# EAGLE design spacecam (EAGLE 6.1)
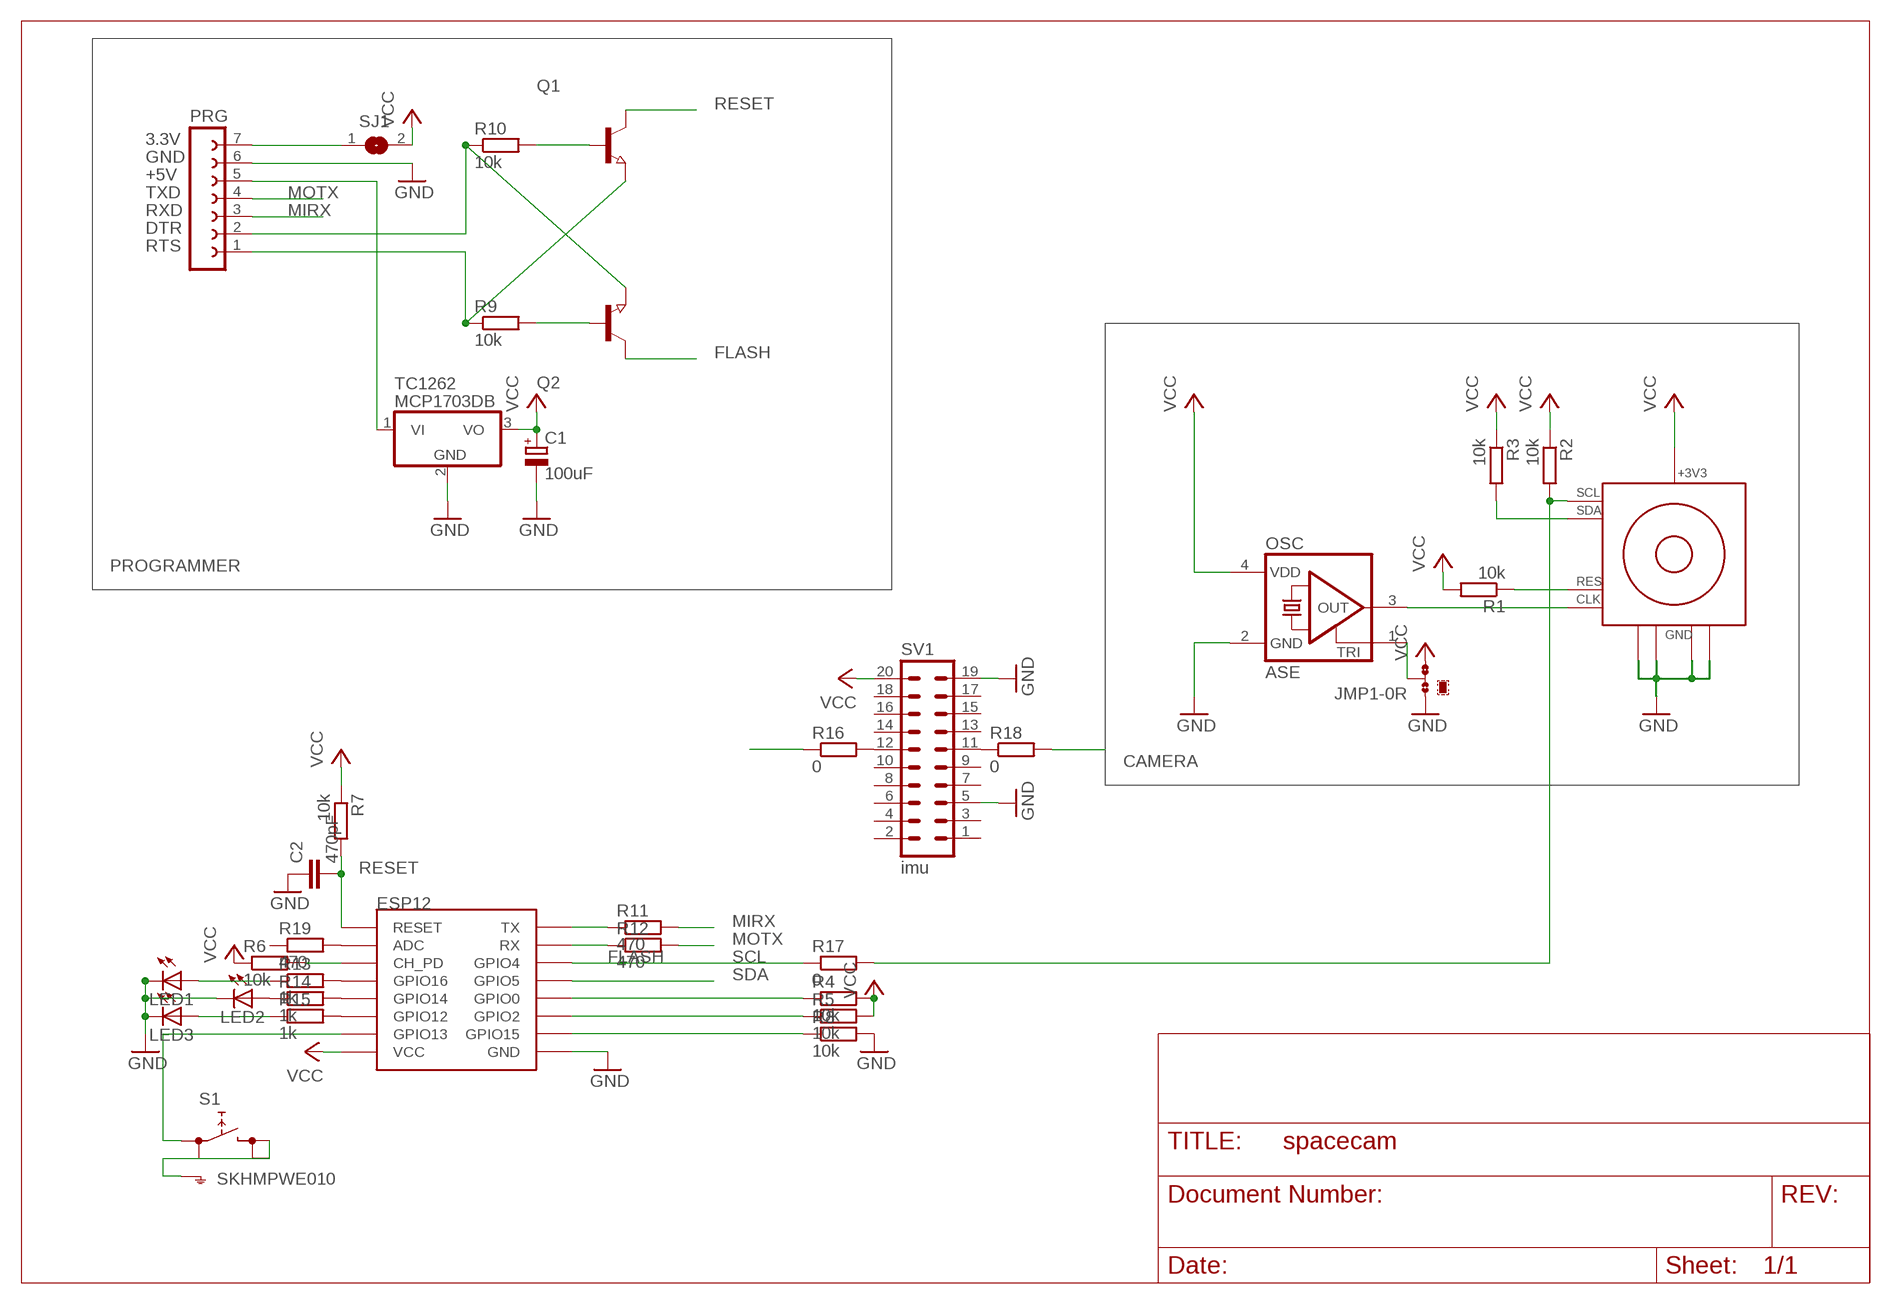
[diagram p0: schematic, sheet 1]

## Parts
C1  100uF  CPOL-EU153CLV-0605  [153CLV-0605]
C2  470pF  C-EUC0603  [C0603]
ESP12  ESP12SMD  [ESP12-SMD]
IR1  Wiimote IR  WII_IR_SENSOR  [WII_IR_SENSOR]
JMP1  0R-JUMPB  [B0R-JMP]
LED1  LEDSML0603  [SML0603]
LED2  LEDSML0603  [SML0603]
LED3  LEDSML0603  [SML0603]
OSC  ASE  [ASE]
PRG  FE07-1  [FE07]
Q1  NPN-TRANSISTOR_SOT23  [SOT23]
Q2  NPN-TRANSISTOR_SOT23  [SOT23]
R1  10k  R-EU_R0603  [R0603]
R2  10k  R-EU_R0603  [R0603]
R3  10k  R-EU_R0603  [R0603]
R4  10k  R-EU_R0603  [R0603]
R5  10k  R-EU_R0603  [R0603]
R6  10k  R-EU_R0603  [R0603]
R7  10k  R-EU_R0603  [R0603]
R8  10k  R-EU_R0603  [R0603]
R9  10k  R-EU_R0603  [R0603]
R10  10k  R-EU_R0603  [R0603]
R11  470  R-EU_R0603  [R0603]
R12  470  R-EU_R0603  [R0603]
R13  1k  R-EU_R0603  [R0603]
R14  1k  R-EU_R0603  [R0603]
R15  1k  R-EU_R0603  [R0603]
R16  0  R-EU_R0603  [R0603]
R17  0  R-EU_R0603  [R0603]
R18  0  R-EU_R0603  [R0603]
R19  470  R-EU_R0603  [R0603]
S1  SKHMPWE010  [SKHMPXE010]
SJ1  SJ  [SJ]
SV1  imu  MA10-2  [MA10-2]
TC1262  MCP1703DB  [SOT223]

## Nets
DTR: PRG.2 Q2.2(E) R10.1
FLASH: ESP12.GPIO0 Q2.3(C) R4.1
GND [power]: C1.- C2.1 ESP12.GND IR1.2_GND@1(GND) IR1.3_GND@2(GND) IR1.GND@3(GND) IR1.GND@4(GND) JMP1.1 LED1.C LED2.C LED3.C OSC.2(GND) PRG.6 R8.2 S1.2(1.2) S1.3(2.1) S1.4(2.2) S1.5(SH) SV1.5 SV1.19 TC1262.2(GND)
MIRX: PRG.3 R11.2
MOTX: PRG.4 R12.2
N$1: IR1.7_CLK(CLK) OSC.3(OUT)
N$2: JMP1.2 OSC.1(TRI)
N$3: IR1.8_RESET(RES) R1.1
N$4: PRG.7 SJ1.1
N$5: ESP12.TXD0(TX) R11.1
N$6: ESP12.GPIO2 R5.1
N$7: ESP12.CH_PD R6.2
N$8: ESP12.RXD0(RX) R12.1
N$9: ESP12.GPIO15 R8.1
N$10: Q2.1(B) R9.2
N$11: Q1.1(B) R10.2
N$12: ESP12.GPIO16 R13.2
N$13: ESP12.GPIO14 R14.2
N$14: ESP12.GPIO12 R15.2
N$15: ESP12.GPIO13 S1.1(1.1)
N$16: LED1.A R13.1
N$17: LED2.A R14.1
N$18: LED3.A R15.1
N$19: R16.2 SV1.12
N$20: IR1.5_SCL(SCL) R2.2 R17.2
N$21: R18.1 SV1.11
N$22: ESP12.ADC R19.2
RESET: C2.2 ESP12.RESET Q1.3(C) R7.2
RTS: PRG.1 Q1.2(E) R9.1
SCL: ESP12.GPIO4 R16.1 R17.1
SDA: ESP12.GPIO5 IR1.6_SDA(SDA) R3.2 R18.2
VCC: C1.+ ESP12.VCC IR1.1_+3V3(+3V3) JMP1.3 OSC.4(VDD) R1.2 R2.1 R3.1 R4.2 R5.2 R6.1 R7.1 SJ1.2 SV1.20 TC1262.3(VO)
VIN: PRG.5 TC1262.1(VI)
Unconnected: R19.1 SV1.1 SV1.2 SV1.3 SV1.4 SV1.6 SV1.7 SV1.8 SV1.9 SV1.10 SV1.13 SV1.14 SV1.15 SV1.16 SV1.17 SV1.18

## Notes on the sheet
- 3.3V
- GND
- +5V
- TXD
- RXD
- DTR
- RTS
- PROGRAMMER
- CAMERA

## Library data of the parts
C1 = rcl:CPOL-EU: POLARIZED CAPACITOR, European symbol
C2 = rcl:C-EU: CAPACITOR, European symbol
ESP12 = esp8266modules:ESP12: ESP8266 Wifi module 12
IR1 = OWN:WII_IR_SENSOR
JMP1 = jump-0r-smd:0R-JUMP: SMD 0R 0805 Jumper
LED1-LED3 = led:LED: LED OSRAM: - CHIPLED LG R971, LG N971, LY N971, LG Q971, LY Q971, LO R971, LY R971 LH N974, LH R974 LS Q976, LO Q976, LY Q976 LO Q996 - Hyper CHIPLED LW Q18S LB Q993, LB Q99A, LB R99A - SideLED LS A670, LO A670, LY A670, LG A670, LP A670 LB A673, LV A673, LT A673, LW A673 LH A674 LY A675 LS A676, LA A676, LO A676, LY A676, LW A676 LS A679, LY A679, LG A679 - Hyper Micro SIDELED® LS Y876, LA Y876, LO Y876, LY Y876 LT Y87S - SmartLED LW L88C, LW L88S LB L89C, LB L89S, LG L890 LS L89K, LO L89K, LY L89K LS L896, LA L896, LO L896, LY L896 - TOPLED LS T670, LO T670, LY T670, LG T670, LP T670 LSG T670, LSP T670, LSY T670, LOP T670, LYG T670 LG T671, LOG T671, LSG T671 LB T673, LV T673, LT T673, LW T673 LH T674 LS T676, LA T676, LO T676, LY T676, LB T676, LH T676, LSB T676, LW T676 LB T67C, LV T67C, LT T67C, LS T67K, LO T67K, LY T67K, LW E67C LS E67B, LA E67B, LO E67B, LY E67B, LB E67C, LV E67C, LT E67C LW T67C LS T679, LY T679, LG T679 LS T770, LO T770, LY T770, LG T770, LP T770 LB T773, LV T773, LT T773, LW T773 LH T774 LS E675, LA E675, LY E675, LS T675 LS T776, LA T776, LO T776, LY T776, LB T776 LHGB T686 LT T68C, LB T68C - Hyper Mini TOPLED® LB M676 - Mini TOPLED Santana® LG M470 LS M47K, LO M47K, LY M47K Source: http://www.osram.convergy.de LUXEON: - LUMILED® LXK2-PW12-R00, LXK2-PW12-S00, LXK2-PW14-U00, LXK2-PW14-V00 LXK2-PM12-R00, LXK2-PM12-S00, LXK2-PM14-U00 LXK2-PE12-Q00, LXK2-PE12-R00, LXK2-PE12-S00, LXK2-PE14-T00, LXK2-PE14-U00 LXK2-PB12-K00, LXK2-PB12-L00, LXK2-PB12-M00, LXK2-PB14-N00, LXK2-PB14-P00, LXK2-PB14-Q00 LXK2-PR12-L00, LXK2-PR12-M00, LXK2-PR14-Q00, LXK2-PR14-R00 LXK2-PD12-Q00, LXK2-PD12-R00, LXK2-PD12-S00 LXK2-PH12-R00, LXK2-PH12-S00 LXK2-PL12-P00, LXK2-PL12-Q00, LXK2-PL12-R00 Source: www.luxeon.com KINGBRIGHT: KA-3528ASYC Source: www.kingbright.com
OSC = crystal:ASE: 3.3Vdc CMOS SMD CRYSTAL CLOCK OSCILLATOR SOurce: www.abracon.com; OC_FARNELL: unknown; OC_NEWARK: unknown
PRG = con-lsta:FE07-1: FEMALE HEADER; OC_FARNELL: unknown; OC_NEWARK: unknown
Q1 Q2 = semicon-smd-ipc:NPN-TRANSISTOR_: NPN TRANSISTOR
R1-R19 = rcl:R-EU_: RESISTOR, European symbol
S1 = switch:SKHMP*E010: 6.2 X 6.5mm TACT Switch (SMD) Source: http://www3.alps.co.jp/WebObjects/catalog.woa/PDF/E/Switch/Tact/SKHM/SKHM.PDF
SJ1 = jumper:SJ: SMD solder JUMPER
SV1 = con-lstb:MA10-2: PIN HEADER; OC_FARNELL: unknown; OC_NEWARK: unknown
TC1262 = linear:MCP1703: 250 mA, 16V, Low Quiescent Current LDO Regulator Source: http://ww1.microchip.com/downloads/en/DeviceDoc/22049b.pdf

## Net classes
0 default: width 0.4 mm, drill 0.6 mm, clearance 0.3 mm
1 power: width 0.6 mm, drill 0.6 mm, clearance 0.3 mm

## Board
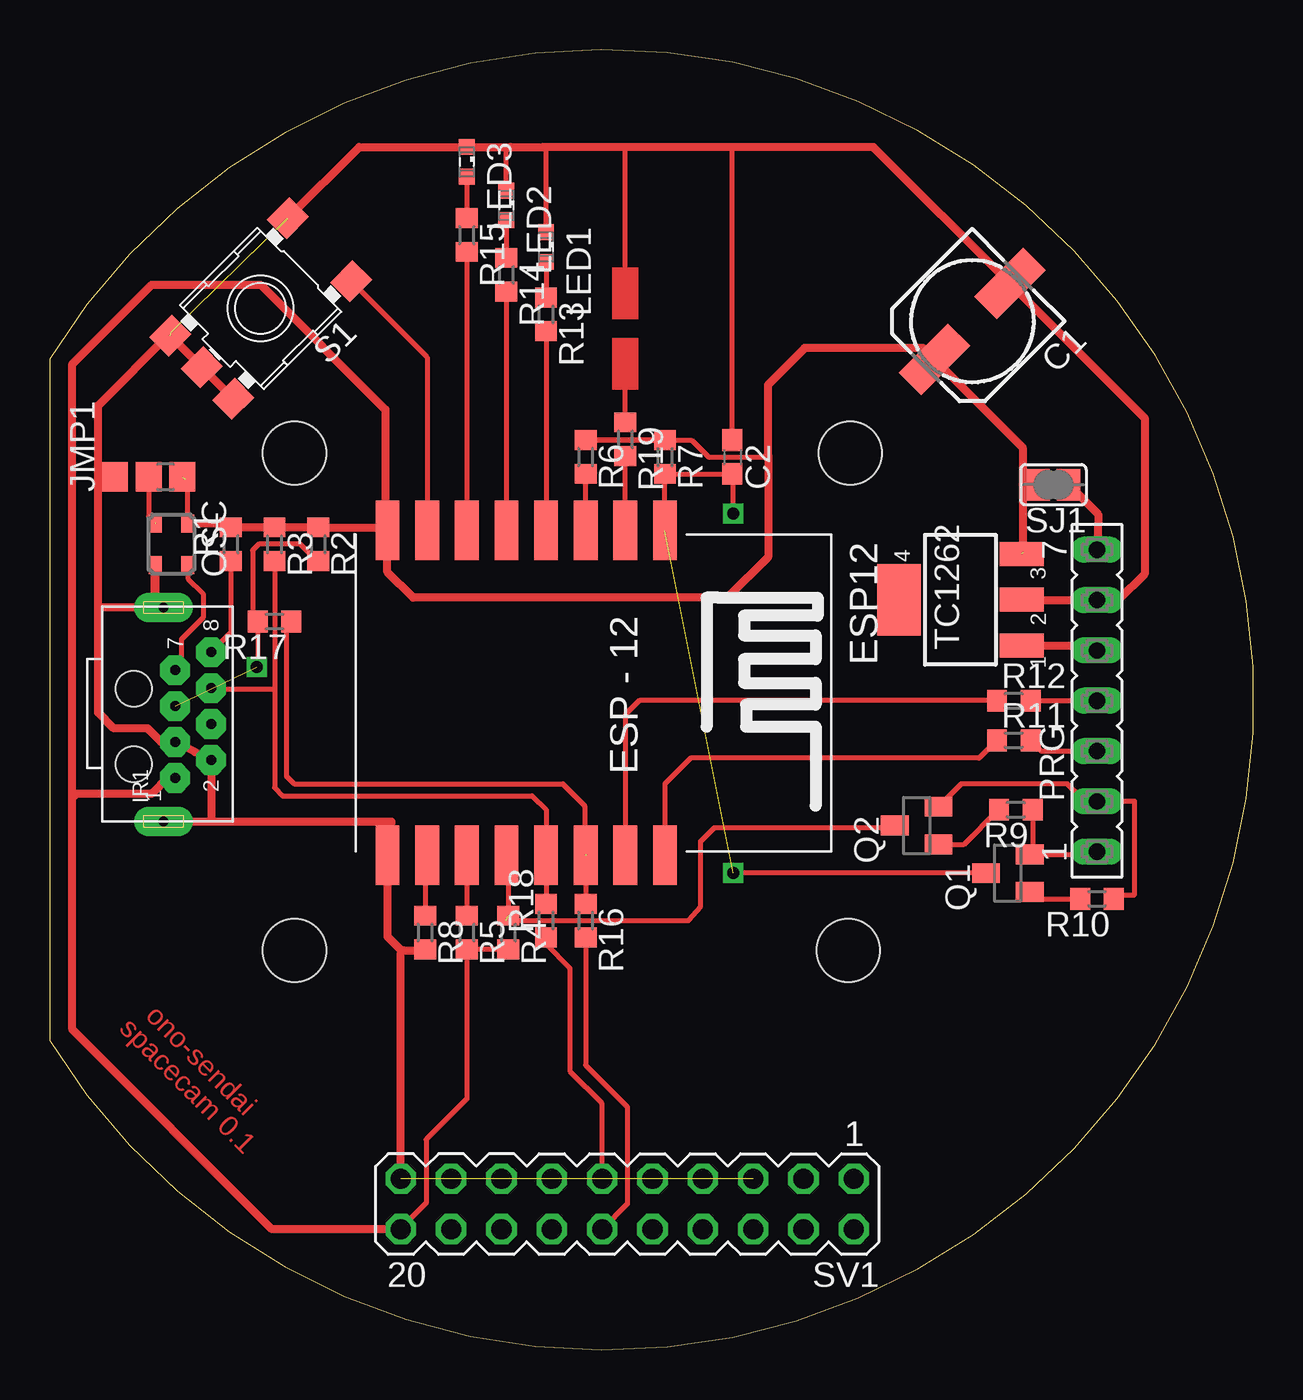
[diagram p1: board, top side]
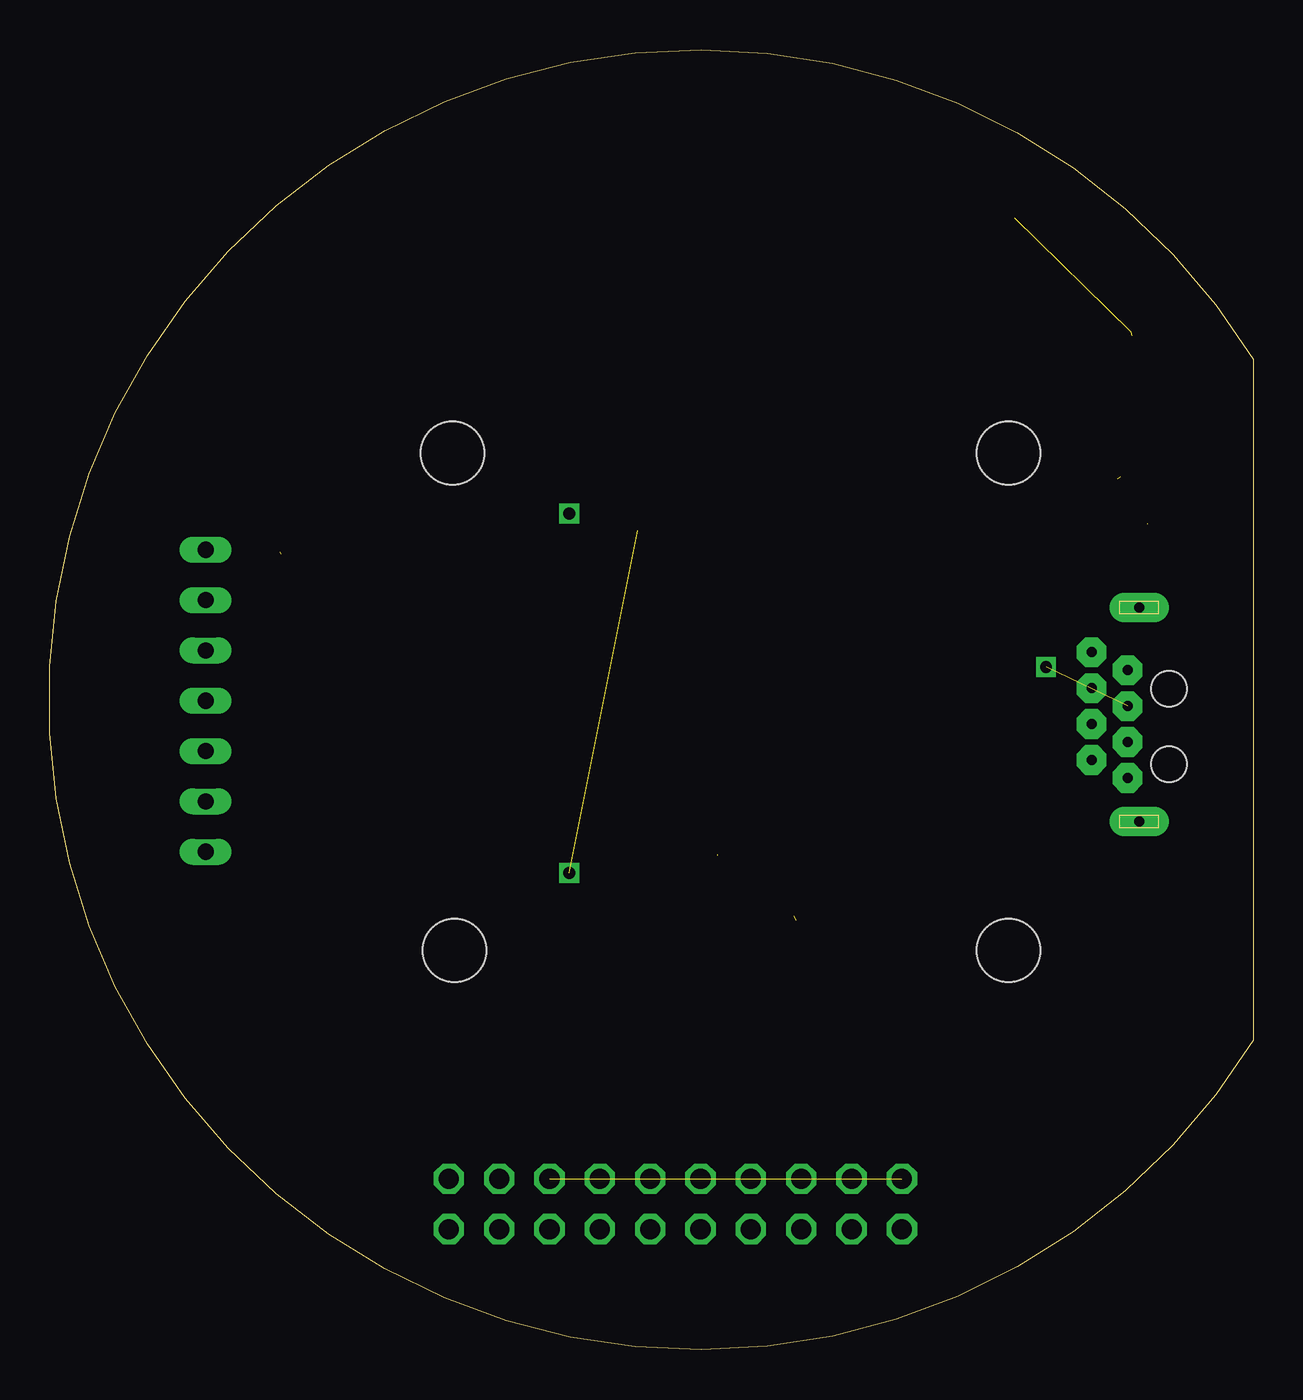
[diagram p2: board, bottom side, seen from below]

Size 60.73 x 65.64 mm. Coordinates in mm from the lower left corner, seen from the top.
Outline: 0,50.02 0,15.62 arc297 0,50.02
Copper layers (1*16): Top 0.035mm / dielectric 1.5mm / Bottom 0.035mm
Design rules: minimum track width 10mil, minimum drill 24mil, track to track 0.3mm, track to pad 0.3mm, pad to pad 0.3mm, via to via 0.3mm, smd to smd 0.3mm, copper to edge 0.2mm, drill to drill 0.3mm, minimum pad ring 10mil, minimum via ring 8mil, stop-mask expansion 4mil, vias tented up to drill 0mil, thermal gap 10mil
Holes 3.2 mm at 12.35,45.27 12.35,20.17 40.3,20.17 40.4,45.27

### Footprints (pad centres in the part's own frame; a part is rotated, then mirrored left to right if it is on the bottom)
153CLV-0605 = smd 3.5 x 1.6: + 2.7,0; - -2.7,0
C0603 = smd 1.1 x 1: 1 -0.85,0; 2 0.85,0
ESP12-SMD = smd 3 x 1.2: ADC -8.3,3.8; CH_PD -8.3,1.8; GND 8.1,-8.2; GPIO0 8.1,-2.2; GPIO2 8.1,-4.2; GPIO4 8.1,1.8; GPIO5 8.1,-0.2; GPIO12 -8.3,-4.2; GPIO13 -8.3,-6.2; GPIO14 -8.3,-2.2; GPIO15 8.1,-6.2; GPIO16 -8.3,-0.2; RESET -8.3,5.8; RXD0 8.1,3.8; TXD0 8.1,5.8; VCC -8.3,-8.2
WII_IR_SENSOR = drill 0.5 pad 1.5 octagon: 1_+3V3 0,0.014; 2_GND@1 0.907,-1.8; 3_GND@2 1.814,0.014; 4_NC 2.721,-1.8; 5_SCL 3.629,0.014; 6_SDA 4.536,-1.8; 7_CLK 5.443,0.014; 8_RESET 6.35,-1.8 | drill 0.5 pad 1.5 long: GND@3 -2.2,0.6; GND@4 8.6,0.6 | hole 1.8: 4.5,2.1; 0.7,2.1
B0R-JMP = smd 1.5 x 1.3: 1 0,1.7; 2 0,0; 3 0,-1.7
SML0603 = smd 0.8 x 0.8: A 0.75,0; C -0.75,0
ASE = smd 0.9 x 0.65: 1 -1.05,-0.825; 2 1.05,-0.825; 3 1.05,0.825; 4 -1.05,0.825
FE07 = drill 0.813 long: 1 -7.62,0; 2 -5.08,0; 3 -2.54,0; 4 0,0; 5 2.54,0; 6 5.08,0; 7 7.62,0
SOT23 = smd 1 x 1.4: 1 -0.95,-1.1; 2 0.95,-1.1; 3 0,1.1
R0603 = smd 1 x 1.1: 1 -0.85,0; 2 0.85,0
SKHMPXE010 = smd 1.6 x 1.4: 1 -4.2,2.25; 2 4.2,2.25; 3 -4.2,-2.25; 4 4.2,-2.25; 5 4.2,0
SJ = smd 1.168 x 1.6: 1 -0.762,0; 2 0.762,0
MA10-2 = drill 1.016 octagon: 1 -11.43,-1.27; 2 -11.43,1.27; 3 -8.89,-1.27; 4 -8.89,1.27; 5 -6.35,-1.27; 6 -6.35,1.27; 7 -3.81,-1.27; 8 -3.81,1.27; 9 -1.27,-1.27; 10 -1.27,1.27; 11 1.27,-1.27; 12 1.27,1.27; 13 3.81,-1.27; 14 3.81,1.27; 15 6.35,-1.27; 16 6.35,1.27; 17 8.89,-1.27; 18 8.89,1.27; 19 11.43,-1.27; 20 11.43,1.27
SOT223 = smd 1.219 x 2.235: 1 -2.311,-3.099; 2 0,-3.099; 3 2.311,-3.099 | smd 3.6 x 2.2: 4 0,3.099

### Placement (x,y rotation side)
C1  46.55,51.92 225 top
C2  34.45,45.07 270 top
ESP12  25.25,33.07 270 top
IR1  6.35,28.87 90 top
JMP1  5,44.07 90 top
LED1  25.05,55.67 270 top
LED2  23.05,57.77 270 top
LED3  21.05,59.97 270 top
OSC  6.15,40.67 270 top
PRG  52.85,32.77 90 top
Q1  48.35,24.07 90 top
Q2  43.75,26.47 90 top
R1  9.15,40.67 90 top
R2  13.55,40.67 270 top
R3  11.35,40.67 270 top
R4  23.15,21.07 270 top
R5  21.05,21.07 270 top
R6  27.05,45.07 270 top
R7  31.05,45.07 270 top
R8  18.95,21.07 270 top
R9  48.75,27.27 180 top
R10  52.85,22.77 180 top
R11  48.65,30.77 0 top
R12  48.65,32.77 0 top
R13  25.05,52.27 270 top
R14  23.05,54.27 270 top
R15  21.05,56.27 270 top
R16  27.05,21.67 270 top
R17  11.35,36.77 180 top
R18  25.05,21.67 90 top
R19  29.05,45.97 270 top
S1  10.65,52.57 225 top
SJ1  50.65,43.67 180 top
SV1  29.15,7.37 180 top
TC1262  45.95,37.87 90 top

### Tracks (layer width: path | path; a pad name or v marks a point on that pad's centre or on a via)
DTR
  Top 0.254: PRG.2 52.23,27.69 51.35,28.57 46,28.57 Q2.2 | 53.73,27.69 PRG.2 | R10.1 53.9,22.97 54.75,22.97 54.75,27.69 PRG.2
FLASH  (1 unrouted)
  Top 0.254: ESP12.GPIO0 23.15,24.97 R4.1 | Q2.3 42.55,26.37 33.55,26.37 32.85,25.67 32.85,22.37 32.25,21.67 23.05,21.67
GND  (3 unrouted)
  Top 0.254: 17.75,20.17 17.85,20.17 | 18.9,20.17 R8.2 | OSC.2 5.21,39.73 5.21,37.73 4.95,37.47 | 2.49,39.73 2.45,39.77 | JMP1.1 2.45,44.07 | LED2.C 23.05,60.52 23.25,60.72 | LED1.C 25.05,60.57 24.9,60.72 | C2.1 34.45,60.67 34.8,60.72 | 29.05,53.42 29.05,60.67 25.05,60.67 25.05,60.72
  Top 0.406: TC1262.2 49.07,37.85 PRG.6 53.93,37.85 55.25,39.17 55.25,47.04 C1.- 41.57,60.72 34.8,60.72 25.05,60.72 24.9,60.72 23.25,60.72 LED3.C 15.62,60.72 S1.3 | IR1.GND@3 8.15,26.67 | 8.15,26.67 17.25,26.67 ESP12.GND 17.05,20.87 17.75,20.17 | 8.15,26.67 IR1.2_GND@1 7.34,30.18 IR1.3_GND@2 5.64,30.68 4.95,31.37 3.25,31.37 2.45,32.17 2.45,37.47 | 18.9,20.17 17.85,20.17 17.72,20.04 SV1.19 | OSC.2 5.32,37.89 | 6.15,51.37 2.45,47.67 2.45,44.07 2.45,39.77 2.45,37.47 | 4.95,37.47 2.45,37.47 | S1.2 S1.5 S1.4
  Top 0.61: 5.32,37.89 IR1.GND@4
MIRX
  Top 0.254: R11.2 50.04,30.23 PRG.3
MOTX
  Top 0.254: R12.2 PRG.4
N$1
  Top 0.254: OSC.3 6.97,38.94 7.75,38.17 7.75,36.97 6.65,35.87 6.65,34.63 IR1.7_CLK
N$2  (1 unrouted)
  Top 0.254: JMP1.2 5,42.07 5.35,41.72
N$3
  Top 0.254: R1.1 9.15,36.22 IR1.8_RESET
N$4
  Top 0.406: SJ1.1 52.9,42.18 PRG.7
N$5
  Top 0.254: R11.1 46.9,29.87 32.35,29.87 31.05,28.57 ESP12.TXD0
N$6
  Top 0.254: ESP12.GPIO2 R5.1
N$7
  Top 0.254: ESP12.CH_PD R6.2
N$8
  Top 0.254: R12.1 29.75,32.77 29.05,32.07 ESP12.RXD0 | ESP12.RXD0 29.05,24.47 29.15,24.37 29.15,24.87 ESP12.RXD0
N$9
  Top 0.254: ESP12.GPIO15 18.95,24.97 R8.1
N$10
  Top 0.254: Q2.1 46.15,25.52 R9.2
N$11
  Top 0.254: Q1.1 49.4,23.07 49.7,22.77 R10.2
N$12
  Top 0.254: R13.2 ESP12.GPIO16
N$13
  Top 0.254: R14.2 ESP12.GPIO14
N$14
  Top 0.254: R15.2 ESP12.GPIO12
N$15
  Top 0.254: ESP12.GPIO13 19.05,50.11 S1.1
N$16
  Top 0.254: LED1.A R13.1
N$17
  Top 0.254: LED2.A R14.1
N$18
  Top 0.254: LED3.A R15.1
N$19
  Top 0.254: R16.2 27.05,14.37 29.15,12.27 29.15,7.37 SV1.12
N$20  (via drill 0.6)  (1 unrouted)
  Top 0.254: R2.2 13.5,39.82 12.65,40.67 10.55,40.67 10.25,40.37 10.25,37.02 R17.2 10.5,34.52 v10.45,34.47
  Bottom 0.254: 10.5,34.52 v10.45,34.47
N$21
  Top 0.254: R18.1 25.05,20.47 26.25,19.27 26.25,14.07 27.85,12.47 27.85,8.67 SV1.11
N$22
  Top 0.254: ESP12.ADC R19.2
N$23
  Top 0.254: 29.05,46.97 29.05,50.47
RESET  (via drill 0.6)  (1 unrouted)
  Top 0.254: ESP12.RESET R7.2 C2.2 34.5,44.17 v34.5,42.22 | Q1.3 v34.5,24.07
RTS
  Top 0.254: R9.1 49.6,25.17 Q1.2 52.72,25.02 PRG.1
SCL  (1 unrouted)
  Top 0.254: R17.1 11.95,36.77 11.95,28.97 12.35,28.57 25.9,28.57 27,27.47 27,25.07 27.05,25.02 | ESP12.GPIO4 R16.1
SDA
  Top 0.254: R3.2 11.35,33.37 | 11.35,33.37 11.35,28.37 11.75,27.97 24.35,27.97 25.05,27.27 ESP12.GPIO5 R18.2 | IR1.6_SDA arc90 8.19,33.37 11.35,33.37
VCC  (2 unrouted)
  Top 0.254: R4.2 R5.2 21.05,12.67 19,10.62 19,7.42 17.72,6.14 SV1.20 | 17.05,40.67 17.05,40.12 | 8.95,41.72 R1.2 | 16.9,41.52 ESP12.VCC | R7.1 R6.1 32.4,45.92 33.25,45.07 36.15,45.07 | 6.97,41.94 6.97,43.84 6.85,43.97
  Top 0.406: 16.9,41.52 R2.1 R3.1 R1.2 | 6.97,41.94 OSC.4 8.95,41.72 | 17.05,40.67 ESP12.VCC | 17.05,40.67 16.95,40.77 16.95,47.47 10.65,53.77 5.15,53.77 1.15,49.77 1.15,27.87 | SV1.20 11.22,6.1 1.15,16.17 1.15,27.87 | IR1.1_+3V3 5.95,28.87 5.15,28.07 1.35,28.07 1.15,27.87 | 36.25,45.17 36.25,40.02 34.2,37.97 18.35,37.97 17.05,39.27 17.05,40.67 | 36.15,45.07 36.25,45.17 | 36.25,45.17 36.25,48.72 38.1,50.57 44.08,50.57 C1.+ 49.1,45.55 49.1,43.67 | 49.1,43.67 49.1,40.27 | SJ1.2 49.1,43.67
VIN
  Top 0.406: TC1262.1 52.6,35.56 PRG.5
(copper drawn outside any net)
  shapes: Top area x2

### Text on the board
Top: spacecam 0.1 | ono-sendai